# EAGLE design untitled (EAGLE 9.6.2)
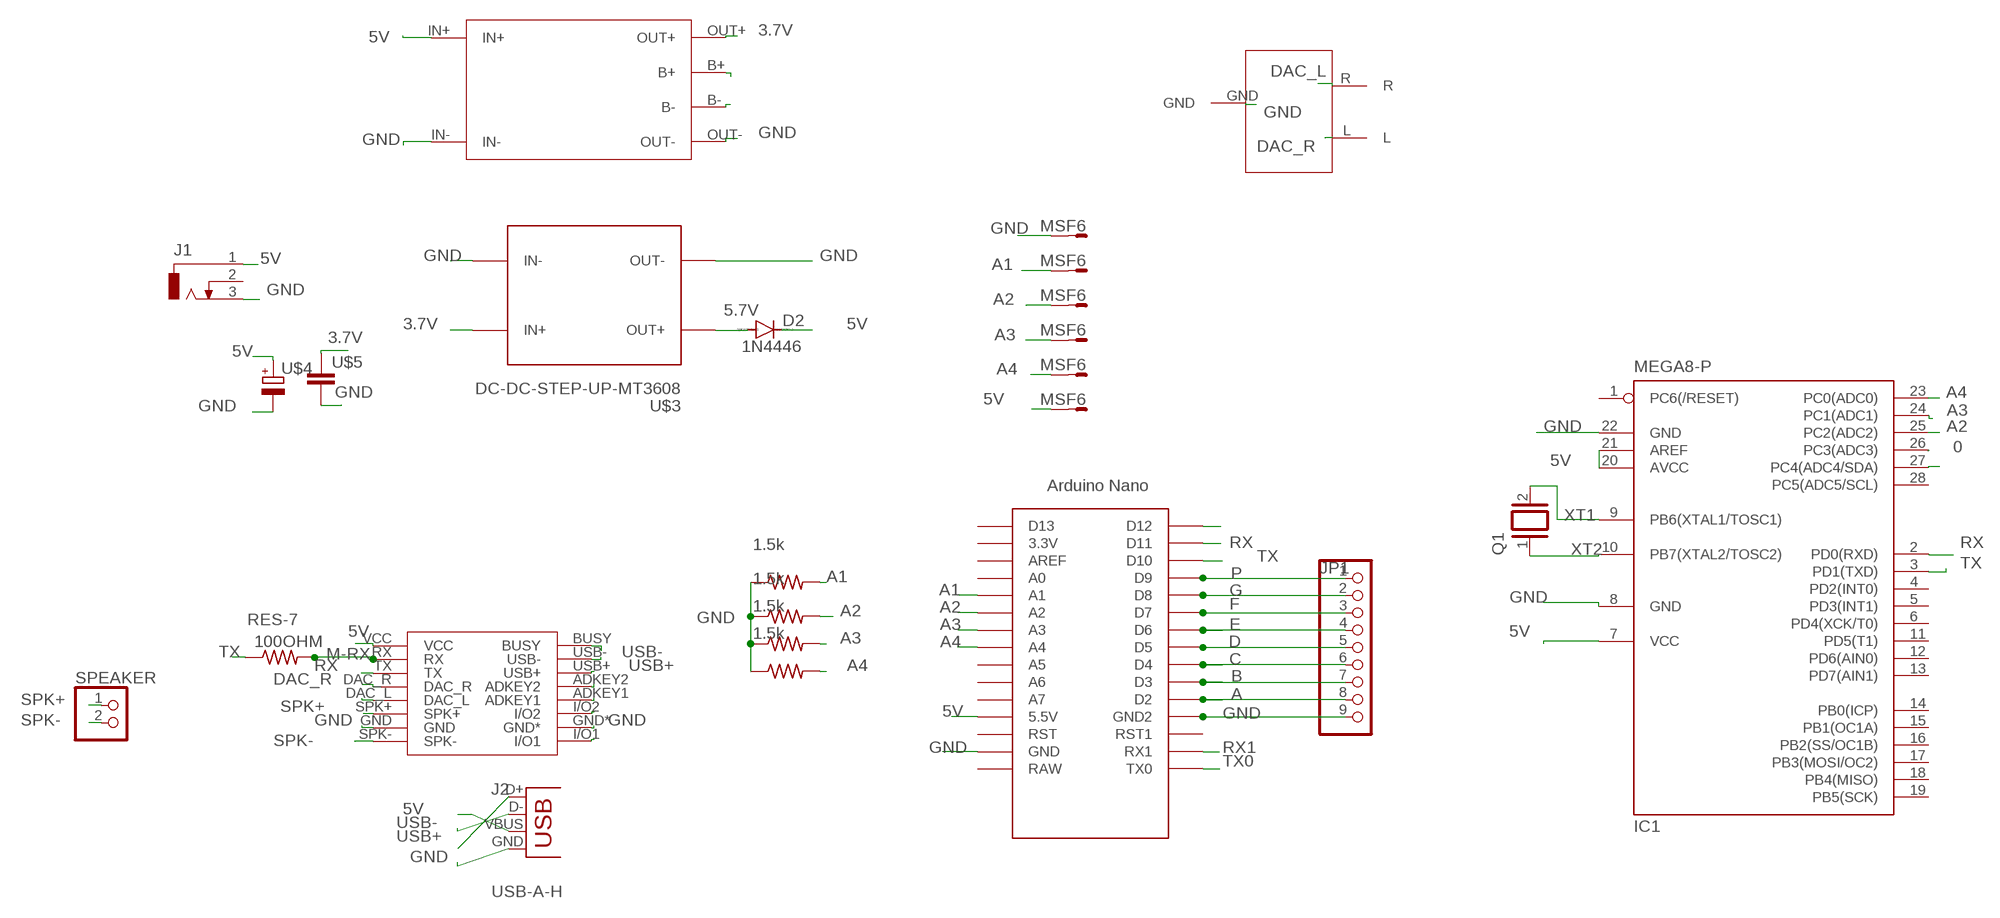
[diagram p0: schematic, sheet 1]

## Parts
1.5K  1.5k  RES-7  [0204/7]
100OHM  RES-7  [0204/7]
100OHM2  1.5k  RES-7  [0204/7]
100OHM3  1.5k  RES-7  [0204/7]
100OHM4  1.5k  RES-7  [0204/7]
D2  1N4446  [DO35-10]
IC1  MEGA8-P  [DIL28-3]
J1  CON_JACK  [DCJ0303]
J2  USB-A-H  [USB-A-H]
JP1  PINHD-1X9  [1X09]
Q1  XTAL/S  [QS]
SPEAKER  PINHD-1X2  [1X02]
ST1  MSF6  [MSF6]
U$1  ARDUINO_NANO  [NANO]
U$2  MP3_MODULE  [MP3_MODULE]
U$3  DC-DC-STEP-UP-MT3608  [DC-DC-STEP-UP-MT3608]
U$4  CAP_POL  [E3,5-8]
U$5  CAPACITOR  [C025-025X050]
U$6  LITHIUM_CHARGER_2A  [LITHIUM-CHARGER-1A]
U$7  EAR-PHONE-SOCKET  [EAR-PHONE-SOCKET]

## Nets
0: IC1.26(PC3(ADC3))
3.7V: U$3.IN+ U$5.1 U$6.OUT+
5.7V: D2.A U$3.OUT+
5V: D2.C IC1.7(VCC) IC1.20(AVCC) IC1.21(AREF) J1.1 J2.VBUS ST1.1 U$1.5V(5.5V) U$2.VCC U$4.+ U$6.IN+
A: JP1.8 U$1.D2
A1: 1.5K.2 ST1.5 U$1.A1
A2: 100OHM2.2 IC1.25(PC2(ADC2)) ST1.4 U$1.A2
A3: 100OHM3.2 IC1.24(PC1(ADC1)) ST1.3 U$1.A3
A4: 100OHM4.2 IC1.23(PC0(ADC0)) ST1.2 U$1.A4
B: JP1.7 U$1.D3
C: JP1.6 U$1.D4
D: JP1.5 U$1.D5
DAC_L: U$2.DAC_L U$7.R
DAC_R: U$2.DAC_R U$7.L
E: JP1.4 U$1.D6
F: JP1.3 U$1.D7
G: JP1.2 U$1.D8
GND: 1.5K.1 100OHM2.1 100OHM3.1 100OHM4.1 IC1.8(GND) IC1.22(GND) J1.3 J2.GND JP1.9 ST1.6 U$1.GND U$1.GND1(GND2) U$2.GND U$2.GND* U$3.IN- U$3.OUT- U$4.- U$5.2 U$6.IN- U$6.OUT- U$7.GND
M-RX: 100OHM.2 U$2.RX
N$7: U$6.B+
N$8: U$2.BUSY
N$9: IC1.27(PC4(ADC4/SDA))
N$11: U$2.ADKEY2
N$12: U$2.ADKEY1
N$13: U$2.I/O2
N$14: U$6.B-
N$15: U$2.I/O1
N$29: U$1.D12
P: JP1.1 U$1.D9
RX: IC1.2(PD0(RXD)) U$1.D11 U$2.TX
RX1: U$1.RX1
SPK+: SPEAKER.1 U$2.SPK+
SPK-: SPEAKER.2 U$2.SPK-
TX: 100OHM.1 IC1.3(PD1(TXD)) U$1.D10
TX0: U$1.TX0
USB+: J2.D+ U$2.USB+
USB-: J2.D- U$2.USB-
XT1: IC1.9(PB6(XTAL1/TOSC1)) Q1.2
XT2: IC1.10(PB7(XTAL2/TOSC2)) Q1.1
Unconnected: IC1.1(PC6(/RESET)) IC1.4(PD2(INT0)) IC1.5(PD3(INT1)) IC1.6(PD4(XCK/T0)) IC1.11(PD5(T1)) IC1.12(PD6(AIN0)) IC1.13(PD7(AIN1)) IC1.14(PB0(ICP)) IC1.15(PB1(OC1A)) IC1.16(PB2(SS/OC1B)) IC1.17(PB3(MOSI/OC2)) IC1.18(PB4(MISO)) IC1.19(PB5(SCK)) IC1.28(PC5(ADC5/SCL)) J1.2 U$1.3.3V U$1.A0 U$1.A5 U$1.A6 U$1.A7 U$1.AREF U$1.D13 U$1.RAW U$1.RST U$1.RST1

## Library data of the parts
1.5K 100OHM 100OHM2-100OHM4 = MIA_LIBRARY-2-2:RES-7
D2 = diode:1N4446: DIODE high speed (Philips)
IC1 = atmel:MEGA8-P: MICROCONTROLLER 8 Kbytes FLASH, 1 kbytes SRAM, 512 bytes EEPROM, USART, 4-channel 10 bit ADC, 2-channel 8 bit ADC Pin compatible with Atmega48, ATMega88, ATMega168 Source: avr.lbr; OC_FARNELL: unknown; OC_NEWARK: unknown
J1 = MIA_LIBRARY-2-2:CON_JACK: DC POWER JACK Source: DCJ0303.pdf; OC_FARNELL: unknown; OC_NEWARK: unknown
J2 = MIA_LIBRARY-2-2:USB: USB Connectors
JP1 = MIA_LIBRARY-2-2:PINHD-1X9: PIN HEADER
Q1 = special:XTAL/S: CRYSTAL
SPEAKER = MIA_LIBRARY-2-2:PINHD-1X2: PIN HEADER
ST1 = con-lumberg:MSF6: MSF CONNECTOR; OC_FARNELL: unknown; OC_NEWARK: unknown
U$1 = MIA_LIBRARY-2-2:ARDUINO_NANO: Arduino Nano
U$2 = MIA_LIBRARY-2-2:MP3_MODULE
U$3 = MIA_LIBRARY-2-2:DC-DC-STEP-UP-MT3608: DC/DC Step-Up Regulator based on MT3608 chip MT3608 datasheet available here: https://www.olimex.com/Products/Breadboarding/BB-PWR-3608/resources/MT3608.pdf Click here to find device on ebay.com <http://www.ebay.com/sch/mt3608+module>
U$4 = MIA_LIBRARY-2-2:CAP_POL
U$5 = MIA_LIBRARY-2-2:CAPACITOR
U$6 = MIA_LIBRARY-2-2:LITHIUM_CHARGER_2A
U$7 = MIA_LIBRARY-2-2:EAR-PHONE-SOCKET

## Board
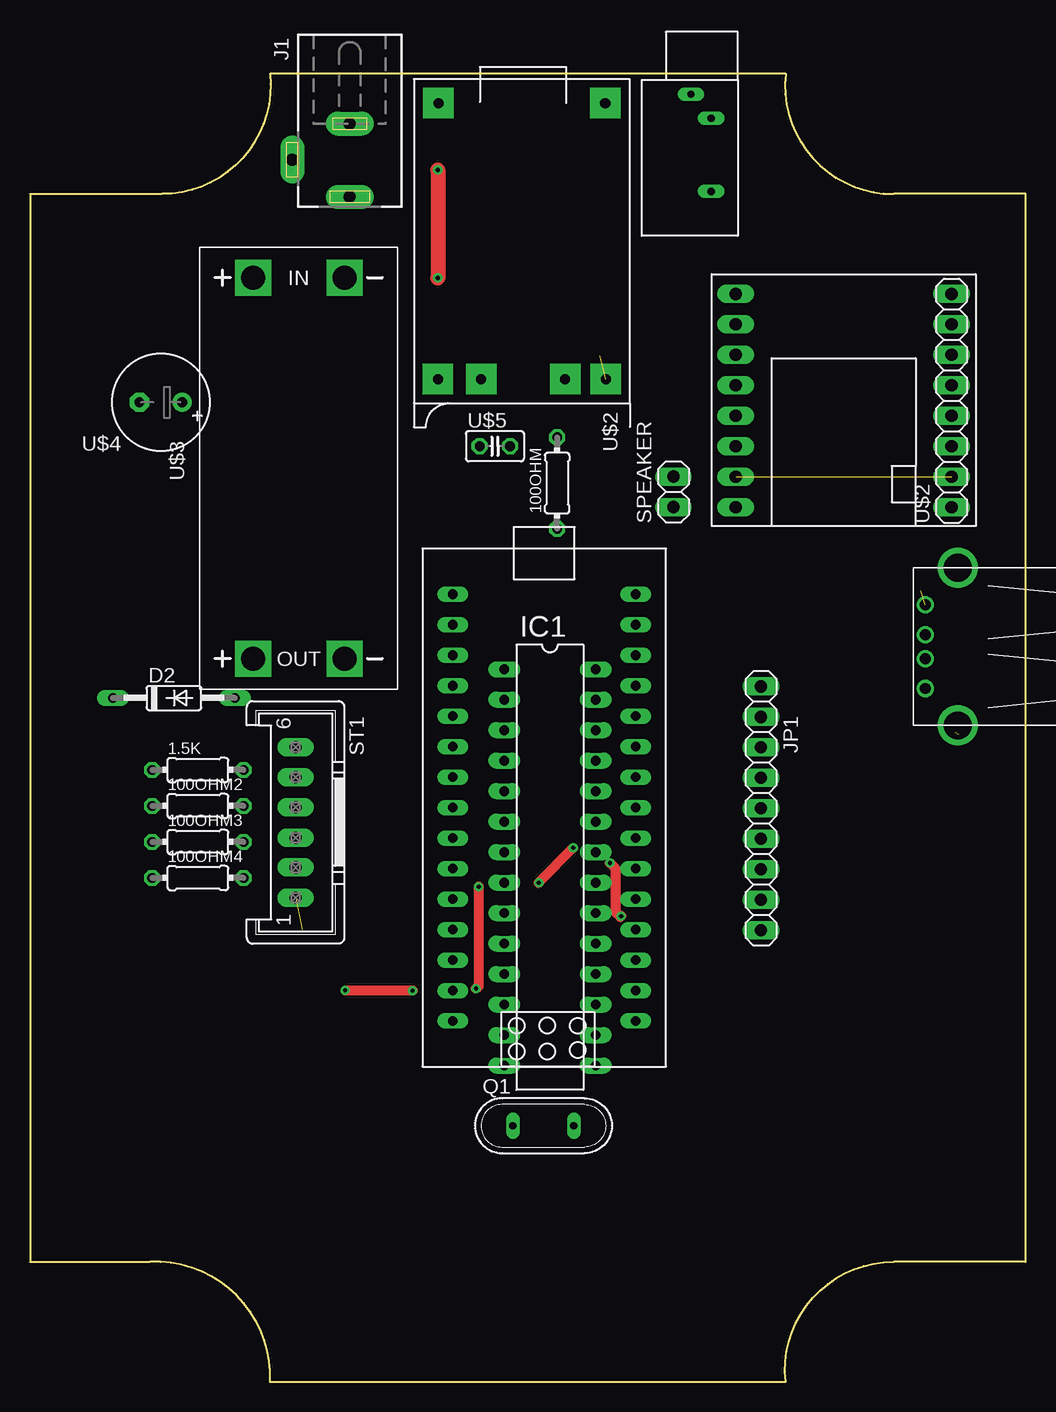
[diagram p1: board, top side]
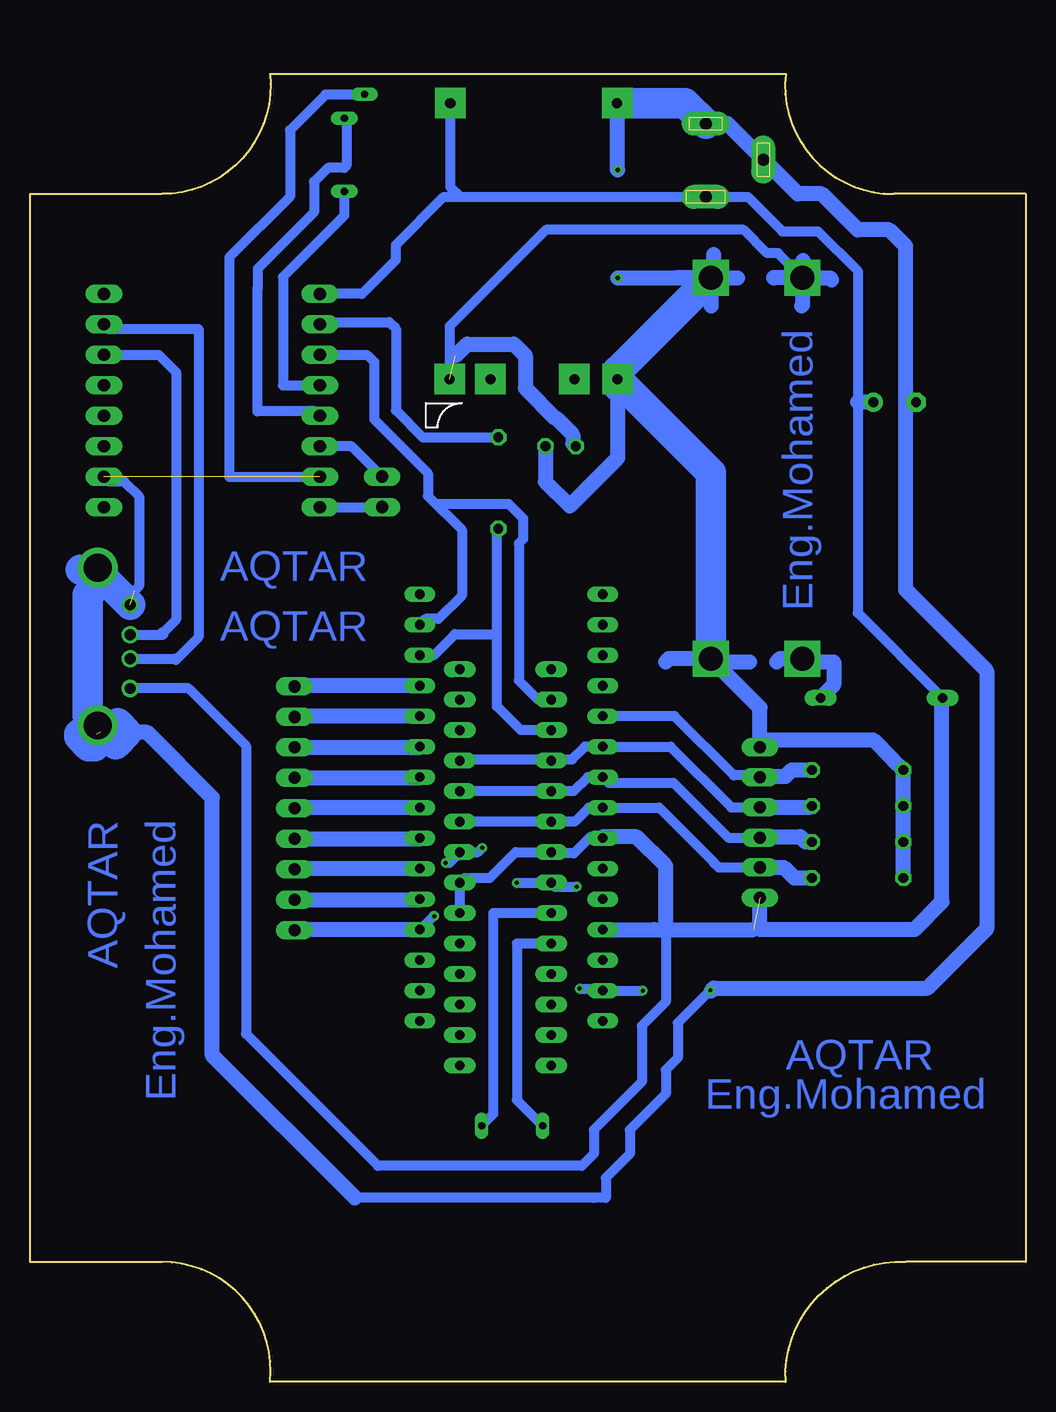
[diagram p2: board, bottom side, seen from below]

Size 83 x 109 mm. Coordinates in mm from the lower left corner, seen from the top.
Outline: 20,0 63,0 arc-96 72,10 83,10 83,99 72,99 arc-96 63,109 20,109 arc-96 11,99 0,99 0,10 10,10 arc-96 20,0
Copper layers (1*16): Top 0.035mm / dielectric 1.5mm / Bottom 0.035mm
Design rules "default *": minimum track width 6mil, minimum drill 0.35mm, track to track 1mm, track to pad 1mm, pad to pad 6mil, via to via 2mm, smd to smd 6mil, copper to edge 40mil, drill to drill 6mil, minimum pad ring 10mil, minimum via ring 8mil, stop-mask expansion 4mil, vias tented up to drill 0mil, thermal gap 10mil

### Footprints (pad centres in the part's own frame; a part is rotated, then mirrored left to right if it is on the bottom)
0204/7 = drill 0.813 octagon: 1 -3.81,0; 2 3.81,0
DO35-10 = drill 0.813 long: A 5.08,0; C -5.08,0
DIL28-3 = drill 0.813 long: 1 -16.51,-3.81; 2 -13.97,-3.81; 3 -11.43,-3.81; 4 -8.89,-3.81; 5 -6.35,-3.81; 6 -3.81,-3.81; 7 -1.27,-3.81; 8 1.27,-3.81; 9 3.81,-3.81; 10 6.35,-3.81; 11 8.89,-3.81; 12 11.43,-3.81; 13 13.97,-3.81; 14 16.51,-3.81; 15 16.51,3.81; 16 13.97,3.81; 17 11.43,3.81; 18 8.89,3.81; 19 6.35,3.81; 20 3.81,3.81; 21 1.27,3.81; 22 -1.27,3.81; 23 -3.81,3.81; 24 -6.35,3.81; 25 -8.89,3.81; 26 -11.43,3.81; 27 -13.97,3.81; 28 -16.51,3.81
DCJ0303 = drill 1 pad 2 long: 1 0,3.1; 2 4.8,0; 3 0,-3
USB-A-H = drill 0.914: D+ 2.718,-1.003; D- 2.718,1.003; GND 2.718,-3.493; VBUS 2.718,3.493 | drill 2.311: P$5 0,-6.566; P$6 0,6.566
1X09 = drill 1.016 long: 1 -10.16,0; 2 -7.62,0; 3 -5.08,0; 4 -2.54,0; 5 0,0; 6 2.54,0; 7 5.08,0; 8 7.62,0; 9 10.16,0
QS = drill 0.61 long: 1 -2.54,0; 2 2.54,0
1X02 = drill 1.016 long: 1 -1.27,0; 2 1.27,0
MSF6 = drill 1.016 long: 1 6.274,-2.54; 2 3.759,-2.54; 3 1.27,-2.54; 4 -1.27,-2.54; 5 -3.759,-2.54; 6 -6.274,-2.54
NANO = drill 0.8 long: 3.3V -10.16,24.13; 5V -10.16,-1.27; A0 -10.16,19.05; A1 -10.16,16.51; A2 -10.16,13.97; A3 -10.16,11.43; A4 -10.16,8.89; A5 -10.16,6.35; A6 -10.16,3.81; A7 -10.16,1.27; AREF -10.16,21.59; D2 5.08,1.27; D3 5.08,3.81; D4 5.08,6.35; D5 5.08,8.89; D6 5.08,11.43; D7 5.08,13.97; D8 5.08,16.51; D9 5.08,19.05; D10 5.08,21.59; D11 5.08,24.13; D12 5.08,26.67; D13 -10.16,26.67; GND -10.16,-6.35; GND1 5.08,-1.27; RAW -10.16,-8.89; RST -10.16,-3.81; RST1 5.08,-3.81; RX1 5.08,-6.35; TX0 5.08,-8.89
MP3_MODULE = drill 1.016 long: ADKEY1 10,-0.81; ADKEY2 10,1.73; BUSY 10,9.35; DAC_L -8,-0.81; DAC_R -8,1.73; GND -8,-5.89; GND* 10,-5.89; I/O1 10,-8.43; I/O2 10,-3.35; RX -8,6.81; SPK+ -8,-8.43; SPK- -8,-3.35; TX -8,4.27; USB+ 10,4.27; USB- 10,6.81; VCC -8,9.35
DC-DC-STEP-UP-MT3608 = drill 2 pad 2.8 square: IN+ 15.24,3.81; IN- 15.24,-3.81; OUT+ -16.51,3.81; OUT- -16.51,-3.81
E3,5-8 = drill 0.813 pad 1.6: + -1.778,0 | drill 0.813 pad 1.6 octagon: - 1.778,0
C025-025X050 = drill 0.813 octagon: 1 -1.27,0; 2 1.27,0
LITHIUM-CHARGER-1A = drill 0.85 pad 2.54 square: B+ -1,11.6; B- -1,4.6; IN+ -24,14.954; IN- -24,1.046; OUT+ -1,15; OUT- -1,1
EAR-PHONE-SOCKET = drill 0.6 long: GND 4.1,11.8; L 5.8,3.7; R 5.8,9.8

### Placement (x,y rotation side)
1.5K  14,51 0 top
100OHM  43.95,74.91 90 top
100OHM2  14,48 0 top
100OHM3  14,45 0 top
100OHM4  14,42 0 top
D2  12,57 0 top
IC1  43.35,42.88 270 top
J1  26.66,101.85 180 top
J2  77.35,61.28 180 top
JP1  60.95,47.8 270 top
Q1  42.8,21.35 0 top
SPEAKER  53.65,74.18 90 top
ST1  24.68,46.63 270 top
U$1  45.41,38.97 0 top
U$2  66.84,81.32 0 top
U$3  22.41,76.78 90 top
U$4  10.91,81.64 180 top
U$5  38.76,77.98 0 top
U$6  33.01,82.57 270 top
U$7  51,95.51 0 top

### Tracks (layer width: path | path; a pad name or v marks a point on that pad's centre or on a via)
3.7V  (1 unrouted)
  Bottom 0.813: U$3.IN+ 20.64,94.06 21.55,94.06 23.49,96 40,96 48.01,87.99 U$6.OUT+
  Bottom 1.27: 47.52,85.52 46.56,86.47 42.66,86.47 41.7,85.52 41.7,82.81 39.17,80.28 39.08,80.28 37.73,78.93 37.73,78.22 U$5.1 | U$3.IN+ 18.58,92 16.31,92 16.15,91.85 | U$3.IN+ 20.98,92.02 21,92 | U$3.IN+ 18.6,89.76 18.68,89.68 | U$3.IN+ 18.6,93.4 18.55,93.45
5.7V
  Bottom 1.27: D2.A 16,58.08 16,60 18.33,60 U$3.OUT+ 20.46,60.27 20.73,60
5V  (1 unrouted)
  Bottom 0.813: 47.14,98.75 J1.1 23.16,98.75 20.29,95.88 17.3,95.88 14,92.58 14,81.68 14,64.08 6.96,57.04 D2.C | U$2.VCC 55.33,90.67 52.5,93.5 52.5,94.75 48.5,98.75 47.14,98.75 | J2.VBUS 69.79,57.79 65,53 65,29 54,18 37,18 36,19 36,21 32,25 32,29.67 30,31.67 30,37.34 30.36,37.7 | U$6.IN+ 47.96,99.57 47.14,98.75 | IC1.20 IC1.21 46.77,42 44.66,42 42.51,44.15 IC1.7 39.43,44.04 37.66,44.04 36.28,45.42 35.26,45.42
  Bottom 1.27: 6.96,57.04 6.96,40.01 9.27,37.7 22.14,37.7 ST1.1 | U$1.5V 31,37.7 30.36,37.7 30,37.7 | 30,37.7 22.7,37.7 | U$4.+ 13.96,81.64 14,81.68 | 30,37.7 30,43 32.42,45.42 35.26,45.42
A
  Bottom 1.27: JP1.8 50.55,40.18 U$1.D2
A1
  Bottom 0.813: ST1.5 22.3,50.55 24.33,50.55 29.27,55.48 U$1.A1
  Bottom 1.27: ST1.5 22.06,50.47 20.01,50.47 19.48,51 1.5K.2
A2
  Bottom 0.813: ST1.4 24.54,47.89 29.59,52.94 U$1.A2 36.74,52.94 37.8,51.88 47.05,51.88 IC1.25
  Bottom 1.27: ST1.4 17.91,47.9 100OHM2.2
A3
  Bottom 0.813: ST1.3 24.79,45.36 29.35,49.92 34.77,49.92 U$1.A3 36.5,50.4 37.65,49.25 47.14,49.25 IC1.24
  Bottom 1.27: ST1.3 22.06,45.44 18.79,45.44 18.35,45 100OHM3.2
A4
  Bottom 0.813: ST1.2 25.6,42.87 26.05,43.32 25.98,43.32 30.53,47.86 U$1.A4 36.4,47.86 37.57,46.69 IC1.23
  Bottom 1.27: ST1.2 20.16,42.87 19.29,42 100OHM4.2
B
  Bottom 1.27: U$1.D3 60.89,42.78 JP1.7
C
  Bottom 1.27: JP1.6 50.55,45.26 U$1.D4
D
  Bottom 1.27: U$1.D5 60.89,47.86 JP1.5
DAC_L
  Bottom 0.813: U$2.DAC_L 59.21,80.88 64.02,80.88 64.02,91.11 64.01,91.12 64.01,92.77 59.31,97.47 59.31,100.02 58.17,101.17 56.79,101.17 56.61,101.35 56.61,105.12 U$7.R
DAC_R
  Bottom 0.813: U$2.DAC_R 61.9,83.05 61.9,92.09 56.8,97.19 U$7.L
E
  Bottom 1.27: JP1.4 50.55,50.34 U$1.D6
F
  Bottom 1.27: JP1.3 50.55,52.88 U$1.D7
G
  Bottom 1.27: U$1.D8 60.89,55.48 JP1.2
GND  (via drill 0.35)  (3 unrouted)
  Top 0.813: v37.41,41.27 37.41,33.01 v37.18,32.78 | v48.35,43.25 48.81,42.79 48.81,39.16 49.22,38.75 v49.28,38.81 | v31.9,32.61 26.31,32.61 v26.28,32.64 | v45.29,44.51 42.42,41.64 v42.42,41.59
  Top 1.27: v34,101 v34,92
  Bottom 0.813: 34.89,82.69 U$6.OUT- 34.01,84.27 | U$2.GND* 76.47,75.06 75.18,75.06 73.91,73.79 73.91,66.31 74.28,65.94 | U$7.GND 55.14,107.27 58.36,107.27 61.31,104.31 61.31,98.79 66.38,93.72 66.38,75.42 58.85,75.42 U$2.GND | U$3.IN- 34.01,84.23 | 1.5K.1 100OHM2.1 100OHM3.1 100OHM4.1 | 55.91,15.34 36,15.34 35,15.34 35,17 33,19 33,21 30,24 30,26 29,27 29,29.92 v26.28,32.64 26.22,32.58 | IC1.8 39.52,41.59 39.52,41.53 39.49,41.5 | 39.49,41.5 39.26,41.27 v37.41,41.27 | v37.18,32.78 35.41,32.78 U$1.GND v31.91,32.62 v31.9,32.61 | v48.35,43.25 48.06,43.25 IC1.22 45.65,44.15 v45.29,44.51 | v49.28,38.81 49.38,38.81 U$1.GND1 | v42.42,41.59 39.58,41.59 39.49,41.5
  Bottom 1.27: J1.3 24.85,104.85 19,99 17,99 14,96 11.36,96 10,94.64 10,81.58 | 26.22,32.58 25.98,32.82 8.18,32.82 3.25,37.75 3.25,59.25 10,66 10,81.58 | 100OHM4.1 1.5K.1 11.1,51.91 12.69,53.5 21.54,53.5 ST1.6 22.14,56.19 U$3.OUT- | U$1.GND1 60.89,37.7 JP1.9 | U$6.OUT- 34.01,83 34.01,76.99 38,73 40.03,75.03 U$5.2 | 55.91,15.34 67.8,27.22 67.8,48.7 73.22,54.12 77.13,54.12 | U$4.- 9.94,81.64 10,81.58 | U$3.OUT- 29.73,60.27 30,60 | U$3.OUT- 25.95,60 23,60 | U$3.IN- 26.2,92 24,92 | U$3.IN- 28.98,92.02 29,92 | U$3.IN- 26,92.24 26,93.96 | U$3.IN- 26.22,89.68 | U$6.IN- 34.06,101.06 v34,101 | v34,92 26.24,92 U$3.IN-
  Bottom 2.54: U$6.OUT- 26.22,75.78 U$3.OUT- | U$3.IN- 34.01,84.23 | 34.01,84.27 34.01,84.23 | 34.01,84.23 34.01,83.03 34.01,83 | J1.3 28.38,106.57 U$6.IN- | J2.GND 76.93,67.07 | 78.76,67.68 76.93,67.68 76.93,67.14 76.93,67.07 | 76.93,67.07 76.93,66.82 78.17,65.58 78.17,55.46 75.87,53.16 74.92,54.1 75.7,54.88 77.59,52.99 78.09,52.99 78.91,53.81 78.91,53.98 77.43,53.98
M-RX
  Bottom 0.813: U$2.RX 58.65,88.32 53.06,88.32 52.5,87.76 52.5,80.97 50.25,78.72 100OHM.2
P
  Bottom 1.27: U$1.D9 60.89,58.02 JP1.1
RX
  Bottom 0.813: U$2.TX 54.9,85.59 54.31,85 54.31,80.22 49.81,75.72 49.81,73.81 | 49.81,73.81 47,71 47,65.53 48.95,63.58 50.01,63.58 U$1.D11 | IC1.2 40.63,56.85 42.24,58.45 42.24,69.89 41.88,70.24 41.88,71.96 43.09,73.17 49.17,73.17 49.81,73.81
SPK+
  Bottom 0.813: U$2.SPK+ 53.67,72.89 SPEAKER.1
SPK-
  Bottom 0.813: SPEAKER.2 56.17,77.97 U$2.SPK-
TX
  Bottom 0.813: 100OHM.1 44.06,70.99 44.06,65.94 44.06,62.59 44.06,62.31 | 49.44,60.56 U$1.D10 49.32,60.56 47.57,62.31 44.06,62.31 | IC1.3 42.08,54.31 44.06,56.29 44.06,61 44.06,62.31
USB+
  Bottom 0.813: U$2.USB+ 72.26,85.59 70.82,84.15 70.82,63.53 71.91,62.44 72.01,62.44 71.86,62.28 J2.D+
USB-
  Bottom 0.813: U$2.USB- 76.47,87.76 68.94,87.76 68.94,62.06 70.82,60.18 70.91,60.28 J2.D-
XT1
  Bottom 0.813: IC1.9 44.38,39.07 44.38,22.31 Q1.2
XT2
  Bottom 0.813: IC1.10 42.4,36.53 42.4,23.49 Q1.1

### Text on the board
Bottom: Eng.Mohamed | AQTAR | AQTAR | AQTAR | Eng.Mohamed | AQTAR | Eng.Mohamed